# EAGLE schematic a323-4pole-vcf (EAGLE 7.6.0)
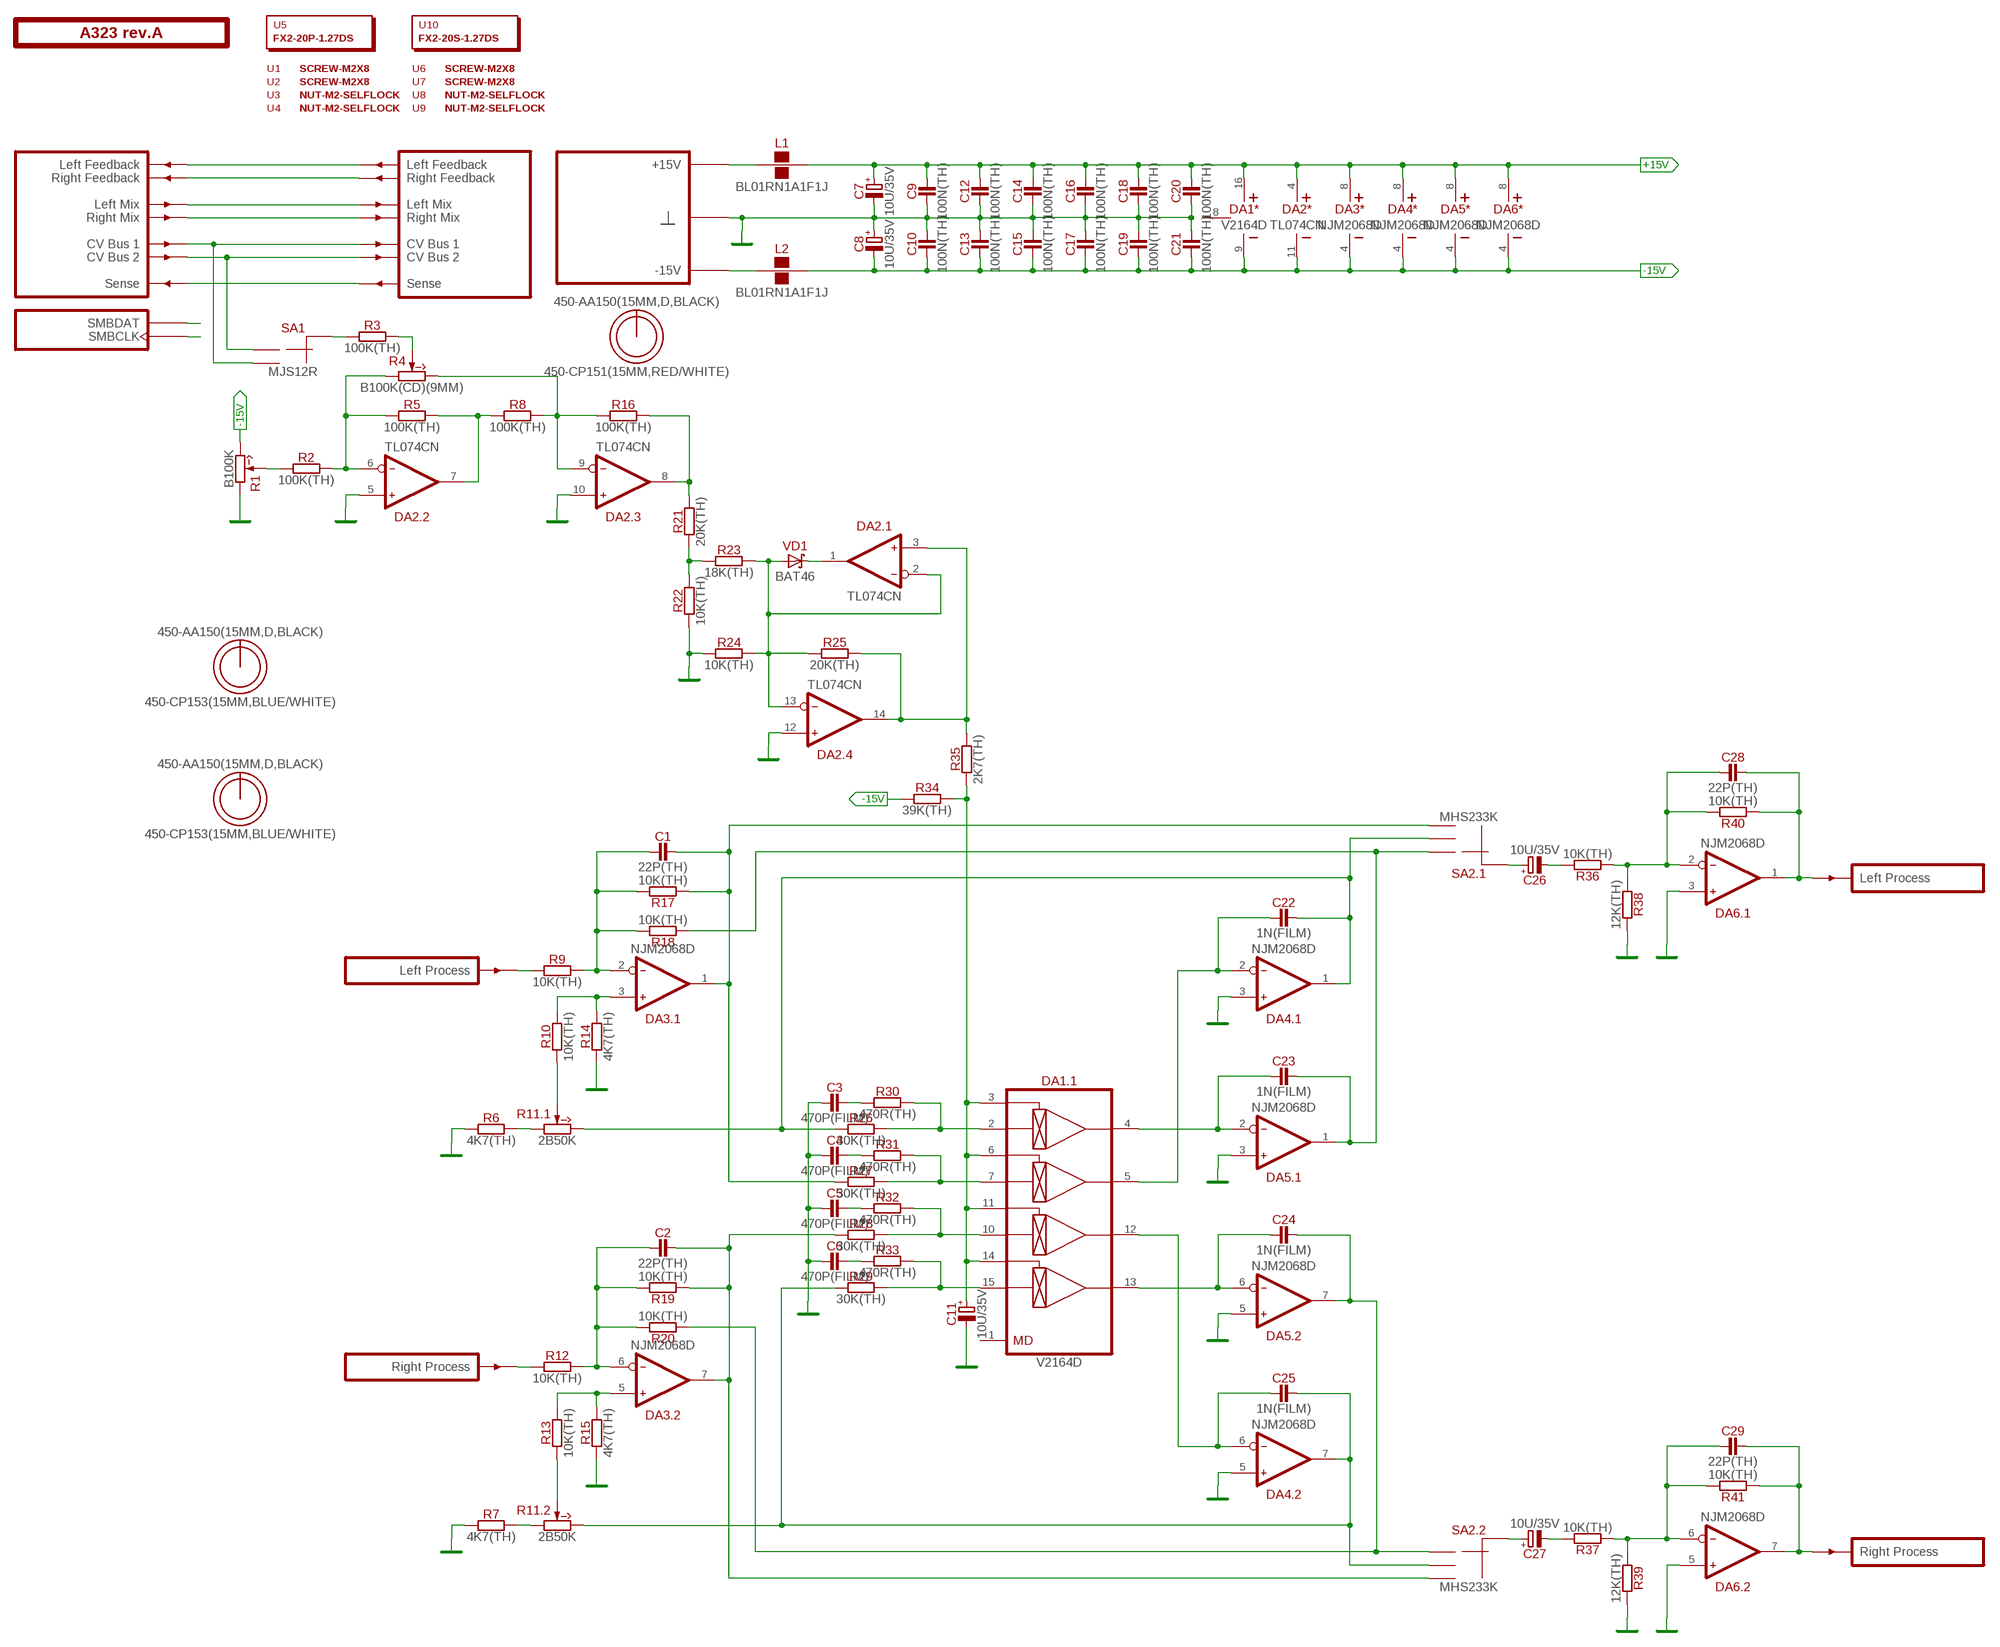
[diagram p0: schematic, sheet 1]

## Parts
C1  22P(TH)  [C050-024X044]
C2  22P(TH)  [C050-024X044]
C3  470P(FILM)  [C050-055X075]
C4  470P(FILM)  [C050-055X075]
C5  470P(FILM)  [C050-055X075]
C6  470P(FILM)  [C050-055X075]
C7  10U/35V  [E2-5]
C8  10U/35V  [E2-5]
C9  100N(TH)  [C050-024X044]
C10  100N(TH)  [C050-024X044]
C11  10U/35V  [E2-5]
C12  100N(TH)  [C050-024X044]
C13  100N(TH)  [C050-024X044]
C14  100N(TH)  [C050-024X044]
C15  100N(TH)  [C050-024X044]
C16  100N(TH)  [C050-024X044]
C17  100N(TH)  [C050-024X044]
C18  100N(TH)  [C050-024X044]
C19  100N(TH)  [C050-024X044]
C20  100N(TH)  [C050-024X044]
C21  100N(TH)  [C050-024X044]
C22  1N(FILM)  [C050-025X075]
C23  1N(FILM)  [C050-025X075]
C24  1N(FILM)  [C050-025X075]
C25  1N(FILM)  [C050-025X075]
C26  10U/35V  [E2-5]
C27  10U/35V  [E2-5]
C28  22P(TH)  [C050-024X044]
C29  22P(TH)  [C050-024X044]
DA1  V2164D  [DIP-16]
DA2  TL074CN  [DIP-14]
DA3  NJM2068D  [DIP-8]
DA4  NJM2068D  [DIP-8]
DA5  NJM2068D  [DIP-8]
DA6  NJM2068D  [DIP-8]
L1  BL01RN1A1F1J  [BL01RN1A]
L2  BL01RN1A1F1J  [BL01RN1A]
O1  450-AA150(15MM,D,BLACK)  [EMPTY]
O2  450-CP153(15MM,BLUE/WHITE)  [EMPTY]
O3  450-AA150(15MM,D,BLACK)  [EMPTY]
O4  450-CP153(15MM,BLUE/WHITE)  [EMPTY]
O5  450-AA150(15MM,D,BLACK)  [EMPTY]
O6  450-CP151(15MM,RED/WHITE)  [EMPTY]
PCB1  A323 rev.A  ST2-BOARD-74  [ST2-BOARD-74]
R1  B100K  [RV11-SINGLE]
R2  100K(TH)  [R-0207/10]
R3  100K(TH)  [R-0207/10]
R4  B100K(CD)(9MM)  [RV09-SINGLE]
R5  100K(TH)  [R-0207/10]
R6  4K7(TH)  [R-0207/10]
R7  4K7(TH)  [R-0207/10]
R8  100K(TH)  [R-0207/10]
R9  10K(TH)  [R-0207/10]
R10  10K(TH)  [R-0207/10]
R11  2B50K  [RV11-DUAL]
R12  10K(TH)  [R-0207/10]
R13  10K(TH)  [R-0207/10]
R14  4K7(TH)  [R-0207/10]
R15  4K7(TH)  [R-0207/10]
R16  100K(TH)  [R-0207/10]
R17  10K(TH)  [R-0207/10]
R18  10K(TH)  [R-0207/10]
R19  10K(TH)  [R-0207/10]
R20  10K(TH)  [R-0207/10]
R21  20K(TH)  [R-0207/10]
R22  10K(TH)  [R-0207/10]
R23  18K(TH)  [R-0207/10]
R24  10K(TH)  [R-0207/10]
R25  20K(TH)  [R-0207/10]
R26  30K(TH)  [R-0207/10]
R27  30K(TH)  [R-0207/10]
R28  30K(TH)  [R-0207/10]
R29  30K(TH)  [R-0207/10]
R30  470R(TH)  [R-0207/10]
R31  470R(TH)  [R-0207/10]
R32  470R(TH)  [R-0207/10]
R33  470R(TH)  [R-0207/10]
R34  39K(TH)  [R-0207/10]
R35  2K7(TH)  [R-0207/10]
R36  10K(TH)  [R-0207/10]
R37  10K(TH)  [R-0207/10]
R38  12K(TH)  [R-0207/10]
R39  12K(TH)  [R-0207/10]
R40  10K(TH)  [R-0207/10]
R41  10K(TH)  [R-0207/10]
SA1  MJS12R  [APEM-MJS12R]
SA2  MHS233K  [APEM-MHS233K]
U1  SCREW-M2X8  [EMPTY]
U2  SCREW-M2X8  [EMPTY]
U3  NUT-M2-SELFLOCK  [EMPTY]
U4  NUT-M2-SELFLOCK  [EMPTY]
U5  FX2-20P-1.27DS  [EMPTY]
U6  SCREW-M2X8  [EMPTY]
U7  SCREW-M2X8  [EMPTY]
U8  NUT-M2-SELFLOCK  [EMPTY]
U9  NUT-M2-SELFLOCK  [EMPTY]
U10  FX2-20S-1.27DS  [EMPTY]
VD1  BAT46  [DO35-7]

## Nets
+15V: C7.+ C9.2 C12.2 C14.2 C16.2 C18.2 C20.2 DA1.16(*:V+) DA2.4(*:V+) DA3.8(*:V+) DA4.8(*:V+) DA5.8(*:V+) DA6.8(*:V+) L1.2
-15V: C8.- C10.1 C13.1 C15.1 C17.1 C19.1 C21.1 DA1.9(*:V-) DA2.11(*:V-) DA3.4(*:V-) DA4.4(*:V-) DA5.4(*:V-) DA6.4(*:V-) L2.2 R1.3(CW) R34.1
GND: C3.1 C4.1 C5.1 C6.1 C7.- C8.+ C9.1 C10.2 C11.- C12.1 C13.2 C14.1 C15.2 C16.1 C17.2 C18.1 C19.2 C20.1 C21.2 DA2.5(.2:IN+) DA2.10(.3:IN+) DA2.12(.4:IN+) DA4.3(.1:IN+) DA4.5(.2:IN+) DA5.3(.1:IN+) DA5.5(.2:IN+) DA6.3(.1:IN+) DA6.5(.2:IN+) PCB1.B4'(GND) PCB1.B4(GND) PCB1.B5'(GND) PCB1.B5(GND) PCB1.B6'(GND) PCB1.B6(GND) PCB1.B7'(GND) PCB1.B7(GND) PCB1.B8'(GND) PCB1.B8(GND) R1.1(CCW) R6.2 R7.2 R14.1 R15.1 R22.1 R24.1 R38.2 R39.2
LMIX: PCB1.ALMIX'(LMIX') PCB1.ALMIX(LMIX)
N$1: L1.1 PCB1.A+15'(P+15V) PCB1.A+15(P+15V) PCB1.B+15'(P+15V) PCB1.B+15(P+15V)
N$2: PCB1.ALFBK'(LFBK') PCB1.ALFBK(LFBK)
N$3: R3.2 R4.2(W)
N$4: PCB1.ARFBK'(RFBK') PCB1.ARFBK(RFBK)
N$5: DA2.6(.2:IN-) R2.2 R4.1(CCW) R5.1
N$6: DA2.7(.2:OUT) R5.2 R8.1
N$7: DA2.9(.3:IN-) R4.3(CW) R8.2 R16.1
N$8: C2.1 DA3.6(.2:IN-) R12.2 R19.2 R20.2
N$9: R3.1 SA1.C(CM)
N$10: C1.1 DA3.2(.1:IN-) R9.2 R17.2 R18.2
N$11: DA3.3(.1:IN+) R10.2 R14.2
N$12: R10.1 R11.2(.1:W)
N$13: R1.2(W) R2.1
N$14: R6.1 R11.1(.1:CCW)
N$15: PCB1.ACV1'(CV1') PCB1.ACV1(CV1) SA1.NO
N$16: PCB1.BSENSE'(SENSE') PCB1.BSENSE(SENSE)
N$17: R21.1 R22.2 R23.1
N$18: DA1.2(.1:IN1) R26.2 R30.2
N$19: C1.2 DA3.1(.1:OUT) R17.1 R27.1 SA2.3
N$20: DA1.7(.1:IN2) R27.2 R31.2
N$21: DA1.10(.1:IN3) R28.2 R32.2
N$22: DA1.15(.1:IN4) R29.2 R33.2
N$23: C3.2 R30.1
N$24: C4.2 R31.1
N$25: L2.1 PCB1.A-15'(P-15V) PCB1.A-15(P-15V) PCB1.B-15'(P-15V) PCB1.B-15(P-15V)
N$26: C5.2 R32.1
N$27: C6.2 R33.1
N$28: DA2.8(.3:OUT) R16.2 R21.2
N$29: DA3.5(.2:IN+) R13.2 R15.2
N$30: R11.2'(.2:W) R13.1
N$31: R7.1 R11.1'(.2:CCW)
N$32: C26.+ SA2.CMN(.1:CM)
N$33: C2.2 DA3.7(.2:OUT) R19.1 R28.1 SA2.3'
N$34: C22.1 DA1.5(.1:OUT2) DA4.2(.1:IN-)
N$35: C22.2 DA4.1(.1:OUT) R11.3(.1:CW) R26.1 SA2.2
N$36: C23.1 DA1.4(.1:OUT1) DA5.2(.1:IN-)
N$37: C23.2 DA5.1(.1:OUT) R18.1 SA2.1
N$38: PCB1.ASMBDAT'(SMBDAT) PCB1.ASMBDAT(SMBDAT)
N$39: C24.1 DA1.13(.1:OUT4) DA5.6(.2:IN-)
N$40: C24.2 DA5.7(.2:OUT) R20.1 SA2.1'
N$41: C25.1 DA1.12(.1:OUT3) DA4.6(.2:IN-)
N$42: PCB1.ACV2'(CV2') PCB1.ACV2(CV2) SA1.NC
N$43: PCB1.ASMBCLK'(SMBCLK) PCB1.ASMBCLK(SMBCLK)
N$44: C25.2 DA4.7(.2:OUT) R11.3'(.2:CW) R29.1 SA2.2'
N$45: C26.- R36.2
N$46: C28.1 DA6.2(.1:IN-) R36.1 R38.1 R40.2
N$47: PCB1.BINL(INL) R9.1
N$48: C28.2 DA6.1(.1:OUT) PCB1.BOUTL'(OUTL) R40.1
N$49: C27.+ SA2.CMN'(.2:CM)
N$50: C27.- R37.2
N$51: C29.1 DA6.6(.2:IN-) R37.1 R39.1 R41.2
N$52: C29.2 DA6.7(.2:OUT) PCB1.BOUTR'(OUTR) R41.1
N$53: DA2.1(.1:OUT) VD1.C
N$54: DA2.3(.1:IN+) DA2.14(.4:OUT) R25.2 R35.2
N$55: DA2.2(.1:IN-) DA2.13(.4:IN-) R23.2 R24.2 R25.1 VD1.A
N$56: PCB1.BINR(INR) R12.1
N$57: C11.+ DA1.3(.1:CV1) DA1.6(.1:CV2) DA1.11(.1:CV3) DA1.14(.1:CV4) R34.2 R35.1
RMIX: PCB1.ARMIX'(RMIX') PCB1.ARMIX(RMIX)
Unconnected: DA1.1(.1:MD)

## Power pins joined to a net without a drawn wire
GND: DA1.8(*:GND)

## Library data of the parts
C1-C6 C22-C25 C28 C29 = capacitors:?
C7 C8 C11 C26 C27 = capacitors-electrolytic:?; MOUSER: 647-USW1V100MDD
C9 C10 C12-C21 = capacitors:?; MOUSER: 81-RCER71H104K0A2H3B
DA1 = ic-coolaudio:V2164
DA2 = ic-ti:TL074
DA3-DA6 = ic-jrc:NJM2068; MOUSER: 513-NJM2068D
L1 L2 = inductors:BL01RN1A?; MOUSER: 81-BL01RN1A1F1J
O1 O3 O5 = hardware:450-AA?; MOUSER: 450-AA150
O2 O4 = hardware:450-C?; MOUSER: 450-CP153
O6 = hardware:450-C?
PCB1 = module-footprints:ST2-BOARD-?
R1 = potentiometers:?
R2 R3 R5 R8 R16 = resistors:?; MOUSER: 71-RN55D-F-100K
R4 = potentiometers:?; MOUSER: 652-PTV09A-4225FB104
R6 R7 R14 R15 R21 R23 R25-R35 R38 R39 = resistors:?
R9 R10 R12 R13 R17-R20 R22 R24 R36 R37 R40 R41 = resistors:?; MOUSER: 71-RN55D-F-10K
R11 = potentiometers:2**?
SA1 = switches:MJS12R; MOUSER: 642-MJS12R
SA2 = switches:MHS233K
U1-U4 U6-U9 = hardware:*?
U5 = hardware:?; MOUSER: 798-FX2-20P-1.27DS71
U10 = hardware:?; MOUSER: 798-FX2-20S-1.27DS71
VD1 = diodes-schottky:?; MOUSER: 511-BAT46